# Altium schematic sheet LED.SchDoc
size A4; SheetNumber: 1; SheetTotal: 1
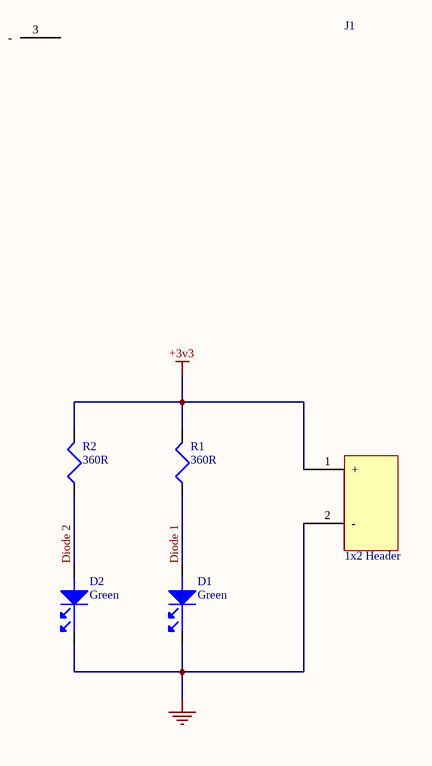
[diagram p0: LED.SchDoc]

## Parts
D1  Green  [LED0603G - duplicate]
D2  Green  [LED0603G - duplicate]
J1  1x2 Header  [HDR1x2]
R1  360R  [R0805]
R2  360R  [R0805]

## Nets
+3v3: J1.1(+) R1.2 R2.2
GND: D1.1 D2.1 J1.2(-)
Diode 1: D1.2 R1.1
Diode 2: D2.2 R2.1

Not connected (* = marked no-connect by the designer): J1 3(-)

## Library data of the parts
D1 D2 = LSM0603453V: LED GREEN CLEAR CHIP 0603 SMD; Manufacturer: Visual Communications; Optoelectronic Device Type: SINGLE COLOR LED; Supplier: Digikey; Supplier Part Number: LSM0603453VCT-ND; Manufacturer Part Number: LSM0603453V; RoHS: Yes; Category: LEDs; Stock: 92418; Pricing: 1=0.46, 10=0.283, 100=0.1626, 1000=0.12726, 2000=0.11666 (USD); Reach SVHC Compliant: Yes; RoHS Compliant: Yes; ComponentLink1URL: https://datasheet.ciiva.com:443/pdfs/VipMasterIC/IC/VISU/VISU-S-A0009188582/VISU-S-A0009188582-1.pdf?src-supplier=IHS+Markit; ComponentLink1Description: https://datasheet.ciiva.com:443/pdfs/VipMasterIC/IC/VISU/VISU-S-A0009188582/VISU-S-A0009188582-1.pdf?src-supplier=IHS+Markit; ComponentLink2URL: http://www.farnell.com/datasheets/2699708.pdf?src-supplier=Farnell; ComponentLink2Description: http://www.farnell.com/datasheets/2699708.pdf?src-supplier=Farnell; ComponentLink3URL: https://vcclite.com/wp-content/uploads/wpallimport/files/files/LSM0603453V.pdf?src-supplier=Digikey; ComponentLink3Description: https://vcclite.com/wp-content/uploads/wpallimport/files/files/LSM0603453V.pdf?src-supplier=Digikey; ComponentLink4URL: http://www.farnell.com/datasheets/2699708.pdf?src-supplier=Newark; ComponentLink4Description: http://www.farnell.com/datasheets/2699708.pdf?src-supplier=Newark
J1 = 22-27-2021: CONN HEADER VERT 2POS 2.54MM; Manufacturer: Molex; Connector Type: BOARD CONNECTOR; Number of Rows Loaded: 1; Number of Contacts: 2; Option: General Purpose; Filter Feature: No; Mating Information: MULTIPLE MATING PARTS AVAILABLE; Contact Pattern: RECTANGULAR; Contact Resistance: 10mR; Contact Style: SQ PIN-SKT; Insulation Resistance: 1GR; Body/Shell Style: RECEPTACLE; Polarization Key: POLARIZED HOUSING; Durability: 25Cycles; Rated Current (Signal): 4A; Mating Contact Pitch: 0.1inch; Mounting Option 1: LOCKING; Body Breadth: 0.23inch; Body Depth: 0.46inch; Body Length: 0.2inch; Plating Thickness: 100uin; Reference Standard: UL; Reliability: COMMERCIAL; Supplier: Digikey; Supplier Part Number: WM4111-ND; Manufacturer Part Number: 22-27-2021; RoHS: Yes; Category: Headers and Wire Housings; Stock: 73435; Pricing: 1=0.3, 10=0.245, 100=0.18, 1000=0.14317, 5000=0.12272, 10000=0.11453 (USD); Mounting Technology: Board; Contact Finish - Mating: NOT SPECIFIED; Contact Finish - Termination: Bright Tin (Sn); Insulation Color: White; Insulation Material: Nylon; Contact Material: Brass; Min Operating Temperature: 0°C; Max Operating Temperature: 75°C; Contact Gender: Male; Termination: Solder; Mixed Contacts: No; JESD-609 Code: e3; Mounting Style: STRAIGHT; Number Of Connectors: 1; Number Of PCB Rows: 1; PCB Contact Pattern: RECTANGULAR; Terminal Pitch: 2.54mm; Terminal Length: 0.14inch; Flammability Rating: UL94 V-0; RoHS Compliant: Yes; DIN Conformance: No; IEC Conformance: No; MIL Conformance: No; Reach SVHC Compliant: Yes; ComponentLink1URL: https://datasheet.ciiva.com:443/pdfs/VipMasterIC/IC/MOLE/MOLE-E-A0003552261/MOLE-S-A0003534498-1.pdf?src-supplier=IHS+Markit; ComponentLink1Description: https://datasheet.ciiva.com:443/pdfs/VipMasterIC/IC/MOLE/MOLE-E-A0003552261/MOLE-S-A0003534498-1.pdf?src-supplier=IHS+Markit
R1 R2 = RT0805BRD07360RL: RES SMD 360 OHM 0.1% 1/8W 0805; Manufacturer: Yageo; Additional Feature: HIGH PRECISION; Power: 125mW; Rated Temperature: 70°C; Temperature Coefficient: 25ppm/°C; Working Voltage: 150V; Package Height: 0.5mm; Package Length: 2mm; Package Width: 1.25mm; Supplier: Digikey; Supplier Part Number: YAG1877CT-ND; Manufacturer Part Number: RT0805BRD07360RL; RoHS: Yes; Category: Chip SMD Resistors; Stock: 3518; Pricing: 1=0.16, 10=0.12, 50=0.0946, 100=0.0846, 500=0.06418, 1000=0.05663 (USD); Mounting Technology: Surface Mount; Pins: 2; Case/Package: 0805; Min Operating Temperature: -55°C; Max Operating Temperature: 155°C; Tolerance: 0.1%; Resistor Type: FIXED RESISTOR; Construction: Chip; Package Style: SMTMeter; Packaging: Tape and Reel; Value: 360R; Technology: THIN FILM; Termination: Wraparound; Reach SVHC Compliant: Yes; RoHS Compliant: Yes; ComponentLink1URL: https://datasheet.ciiva.com:443/pdfs/VipMasterIC/IC/YAGO/YAGO-S-A0008510989/YAGO-S-A0008510989-1.pdf?src-supplier=IHS+Markit; ComponentLink1Description: https://datasheet.ciiva.com:443/pdfs/VipMasterIC/IC/YAGO/YAGO-S-A0008510989/YAGO-S-A0008510989-1.pdf?src-supplier=IHS+Markit; ComponentLink2URL: https://datasheet.ciiva.com/12810/pyu-rt-1-to-0-05-rohs-l-4-12810054.pdf?src-supplier=Mouser; ComponentLink2Description: https://datasheet.ciiva.com/12810/pyu-rt-1-to-0-05-rohs-l-4-12810054.pdf?src-supplier=Mouser